# EAGLE design LSF0204-Breakout (EAGLE 7.1.0)
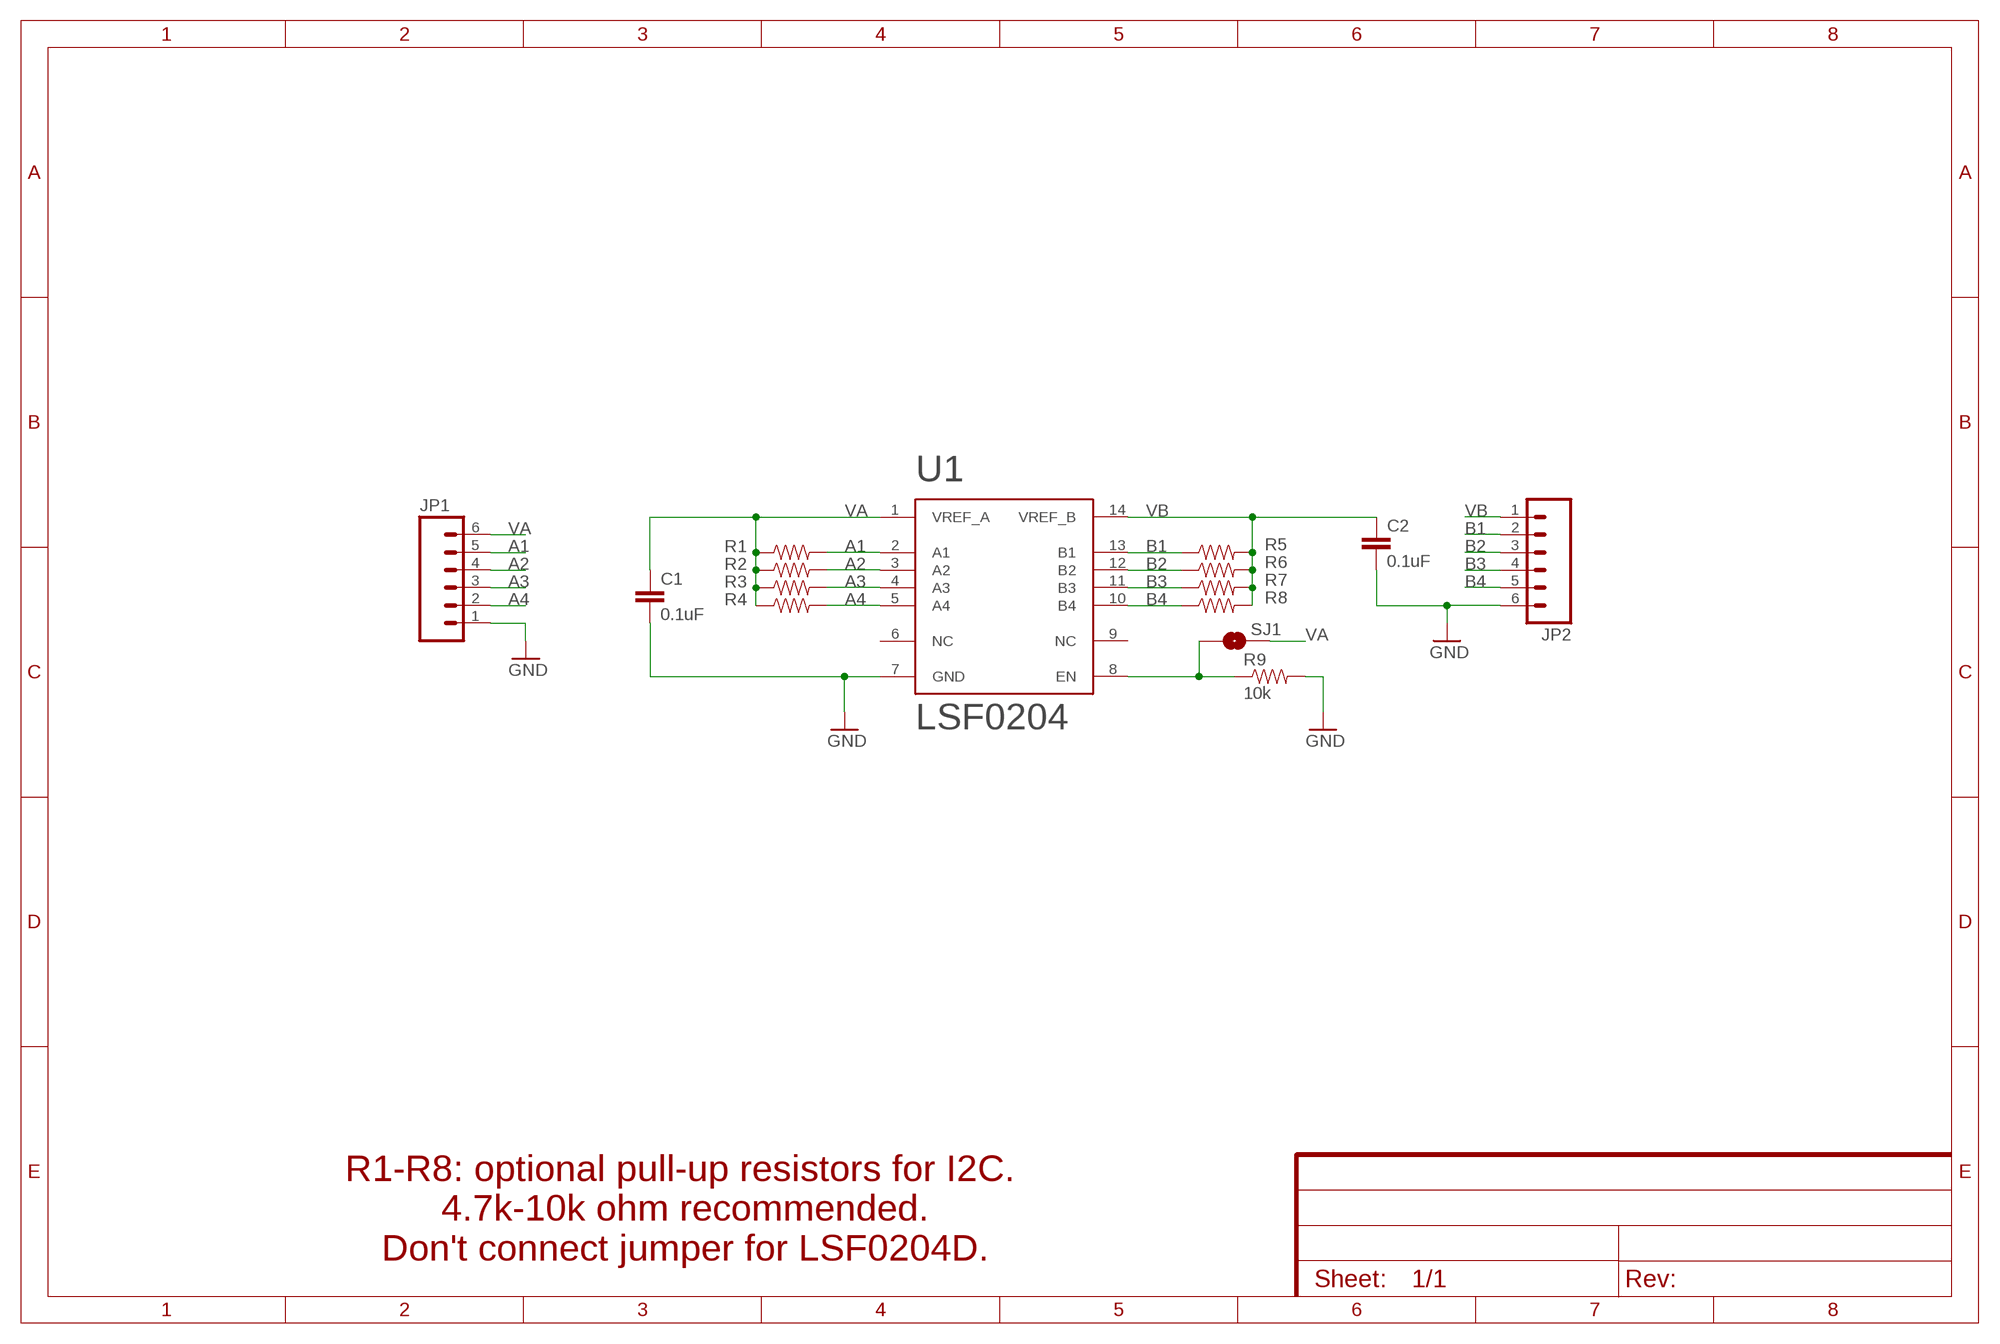
[diagram p0: schematic, sheet 1]
FRAME2 (FRAME-A4L): CNAME: LSF0204 Breakout Board; CREVISION: 1; DESIGNER: Francesco Truzzi; LICENSE: Released under CC BY-NC-SA 4.0

## Parts
C1  0.1uF  CAP0805  [0805]
C2  0.1uF  CAP0805  [0805]
JP1  M06LOCK  [1X06_LOCK]
JP2  M06LOCK  [1X06_LOCK]
R1  RESISTOR0805-RES  [0805]
R2  RESISTOR0805-RES  [0805]
R3  RESISTOR0805-RES  [0805]
R4  RESISTOR0805-RES  [0805]
R5  RESISTOR0805-RES  [0805]
R6  RESISTOR0805-RES  [0805]
R7  RESISTOR0805-RES  [0805]
R8  RESISTOR0805-RES  [0805]
R9  10k  RESISTOR0805-RES  [0805]
SJ1  JUMPER-PAD-2-NO  [PAD-JUMPER-2-NO_NO_SILK]
U1  LSF0204  [TSSOP_14]

## Nets
A1: JP1.5 R1.2 U1.2(A1)
A2: JP1.4 R2.2 U1.3(A2)
A3: JP1.3 R3.2 U1.4(A3)
A4: JP1.2 R4.2 U1.5(A4)
B1: JP2.2 R5.1 U1.13(B1)
B2: JP2.3 R6.1 U1.12(B2)
B3: JP2.4 R7.1 U1.11(B3)
B4: JP2.5 R8.1 U1.10(B4)
GND: C1.2 C2.2 JP1.1 JP2.6 R9.2 U1.7(GND)
N$1: R9.1 SJ1.1 U1.8(EN)
VA: C1.1 JP1.6 R1.1 R2.1 R3.1 R4.1 SJ1.2 U1.1(VREF_A)
VB: C2.1 JP2.1 R5.2 R6.2 R7.2 R8.2 U1.14(VREF_B)
Unconnected: U1.6(NC) U1.9(NC)

## Notes on the sheet
- R1-R8: optional pull-up resistors for I2C. 
  4.7k-10k ohm recommended.
  Don't connect jumper for LSF0204D.

## Library data of the parts
C1 C2 = SparkFun-Passives:CAP: Capacitor Standard 0603 ceramic capacitor, and 0.1" leaded capacitor.
JP1 JP2 = SparkFun-Connectors:M06: Header 6 Standard 6-pin 0.1" header. Use with straight break away headers (SKU : PRT-00116), right angle break away headers (PRT-00553), swiss pins (PRT-00743), machine pins (PRT-00117), and female headers (PRT-00115). Molex polarized connector foot print use with SKU : PRT-08094 with associated crimp pins and housings. NOTES ON THE VARIANTS LOCK and LOCK_LONGPADS... This footprint was designed to help hold the alignment of a through-hole component (i.e. 6-pin header) while soldering it into place. You may notice that each hole has been shifted either up or down by 0.005 of an inch from it's more standard position (which is a perfectly straight line). This slight alteration caused the pins (the squares in the middle) to touch the edges of the holes. Because they are alternating, it causes a "brace" to hold the component in place. 0.005 has proven to be the perfect amount of "off-center" position when using our standard breakaway headers. Although looks a little odd when you look at the bare footprint, once you have a header in there, the alteration is very hard to notice. Also,if you push a header all the way into place, it is covered up entirely on the bottom side. This idea of altering the position of holes to aid alignment will be further integrated into the Sparkfun Library for other footprints. It can help hold any component with 3 or more connection pins.
R1-R9 = SparkFun-Passives:RESISTOR: Resistor Basic schematic elements and footprints for 0603, 1206, and PTH resistors.
SJ1 = SparkFun-Passives:JUMPER-PAD-2-NO
U1 = Fra:LSF0204

## Board
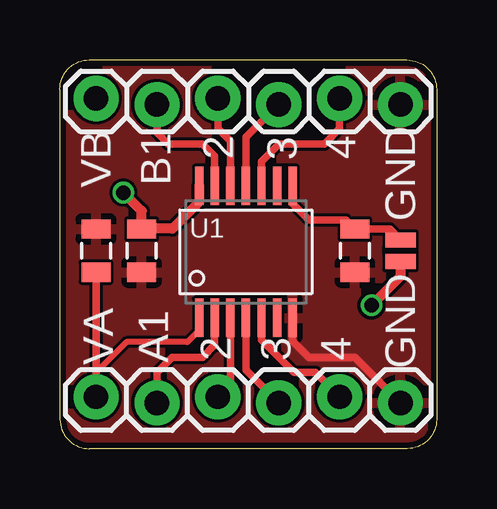
[diagram p1: board, top side]
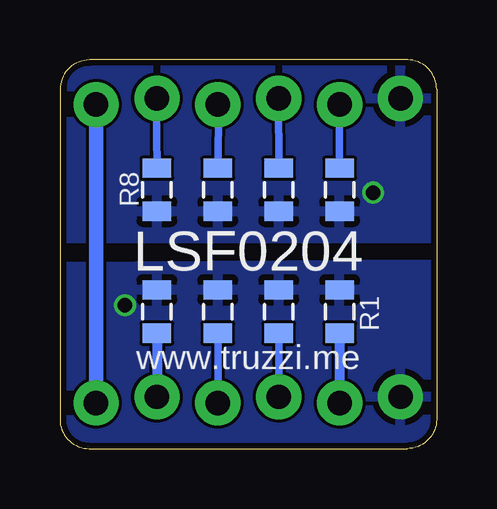
[diagram p2: board, bottom side, seen from below]

Size 15.71 x 16.21 mm. Coordinates in mm from the lower left corner, seen from the top.
Outline: 0,15 0,1.22 arc90 1.22,0 14.49,0 arc90 15.71,1.22 15.71,14.97 arc90 14.48,16.21 1.21,16.21 arc90 0,15
Copper layers (1*16): Top 0.035mm / dielectric 1.5mm / Bottom 0.035mm
Design rules "dirt_cheap_dirty_boards.v1": minimum track width 5mil, minimum drill 12mil, track to track 5mil, track to pad 5mil, pad to pad 5mil, via to via 5mil, smd to smd 0mil, copper to edge 10mil, drill to drill 10mil, minimum pad ring 10mil, minimum via ring 6mil, stop-mask expansion 2mil, vias tented up to drill 25mil, thermal gap 10mil

### Footprints (pad centres in the part's own frame; a part is rotated, then mirrored left to right if it is on the bottom)
0805 = smd 0.8 x 1.2: 1 -0.9,0; 2 0.9,0
1X06_LOCK = drill 1.016 pad 1.88: 1 0,0; 2 2.54,-0.254; 3 5.08,0; 4 7.62,-0.254; 5 10.16,0; 6 12.7,-0.254
PAD-JUMPER-2-NO_NO_SILK = smd 0.635 x 1.27: 1 -0.45,0; 2 0.45,0
TSSOP_14 = smd 0.35 x 1.6: 1 -2.05,-2.8; 2 -1.4,-2.8; 3 -0.75,-2.8; 4 -0.1,-2.8; 5 0.55,-2.8; 6 1.2,-2.8; 7 1.85,-2.8; 8 1.85,2.7; 9 1.2,2.7; 10 0.55,2.7; 11 -0.1,2.7; 12 -0.75,2.7; 13 -1.4,2.7; 14 -2.05,2.7

### Placement (x,y rotation side)
C1  1.5,8.25 90 top
C2  3.41,8.25 270 top
JP1  14.21,1.9 180 top
JP2  1.5,14.61 0 top
R1  4.04,5.71 270 bottom
R2  6.59,5.71 270 bottom
R3  9.12,5.71 270 bottom
R4  11.67,5.71 270 bottom
R5  4.04,10.79 270 bottom
R6  6.59,10.79 270 bottom
R7  9.12,10.79 270 bottom
R8  11.67,10.79 270 bottom
R9  12.3,8.25 270 top
SJ1  14.21,8.25 270 top
U1  7.86,8.25 0 top

### Tracks (layer width: path | path; a pad name or v marks a point on that pad's centre or on a via)
A1
  Top 0.305: U1.2 6.46,4.31 5.95,3.81 4.68,3.81 4.04,3.17 JP1.5
  Bottom 0.406: R1.2 JP1.5
A2
  Top 0.305: U1.3 7.11,2.68 JP1.4
  Bottom 0.305: R2.2 JP1.4
A3
  Top 0.305: U1.4 7.75,3.27 JP1.3
  Bottom 0.305: R3.2 JP1.3
A4
  Top 0.305: U1.5 8.41,4.53 9.76,3.17 10.65,3.17 JP1.2
  Bottom 0.406: R4.2 JP1.2
B1
  Top 0.305: U1.13 6.46,12.2 5.95,12.7 4.52,12.7 4.04,13.18 JP2.2
  Bottom 0.305: JP2.2 R5.1
B2
  Top 0.305: U1.12 7.11,12.81 6.59,13.34 JP2.3
  Bottom 0.305: R6.1 6.6,14.59
  Bottom 0.406: 6.6,14.59 JP2.3
B3
  Top 0.305: U1.11 7.75,12.98 JP2.4
  Bottom 0.305: R7.1 9.1,14.32
  Bottom 0.406: 9.1,14.32 JP2.4
B4
  Top 0.305: U1.10 8.41,11.98 9.12,12.7 11.03,12.7 11.67,13.34 JP2.5
  Bottom 0.305: R8.1 11.7,14.57
  Bottom 0.406: 11.7,14.57 JP2.5
GND
  Top 0.305: U1.7 9.71,4.5 10.39,3.81 12.3,3.81 JP1.1
  Bottom 0.61: JP2.6 JP1.1
  pour Top: 14.49,0 1.2,0 arc-90 0,1.2 0,15.07 arc-90 1.14,16.21 14.42,16.21 arc-90 15.71,14.92 15.71,1.22 arc-90
N$1
  Top 0.305: U1.8 9.71,10.21 10.39,9.53 11.93,9.53 R9.1 13.75,9.15 SJ1.1
VA  (via drill 0.6)
  Top 0.254: U1.1 5.8,4.93 5.32,4.45 2.78,4.45 1.5,3.17 JP1.6
  Top 0.305: JP1.6 C1.1
  Top 0.406: SJ1.2 14.21,7.18 v13,5.97
  pour Bottom: 0,7.67 15.7,7.57 15.61,1.04 arc-89 14.53,-0.02 1.17,-0.03 arc-90 0,1.15
VB  (via drill 0.6)
  Top 0.406: v2.65,10.68 3.41,9.91 C2.1 3.43,9.18 4.7,9.18 5.8,10.29 U1.14
  pour Bottom: 0,8.78 0.01,14.97 arc-91 1.1,16.18 14.52,16.18 arc-91 15.78,14.9 15.7,8.78

### Text on the board
tPlace: VB | B1 | 2 | 3 | 4 | GND | GND | VA | A1 | 2 | 3 | 4
bPlace: LSF0204 | www.truzzi.me
_tNames: U1